# Altium schematic sheet Sheet1 (1).SchDoc
size 594 x 420 mm; Organization: ФЕЛ, ДК-81; DocumentNumber: 1; SheetNumber: 1; SheetTotal: 1
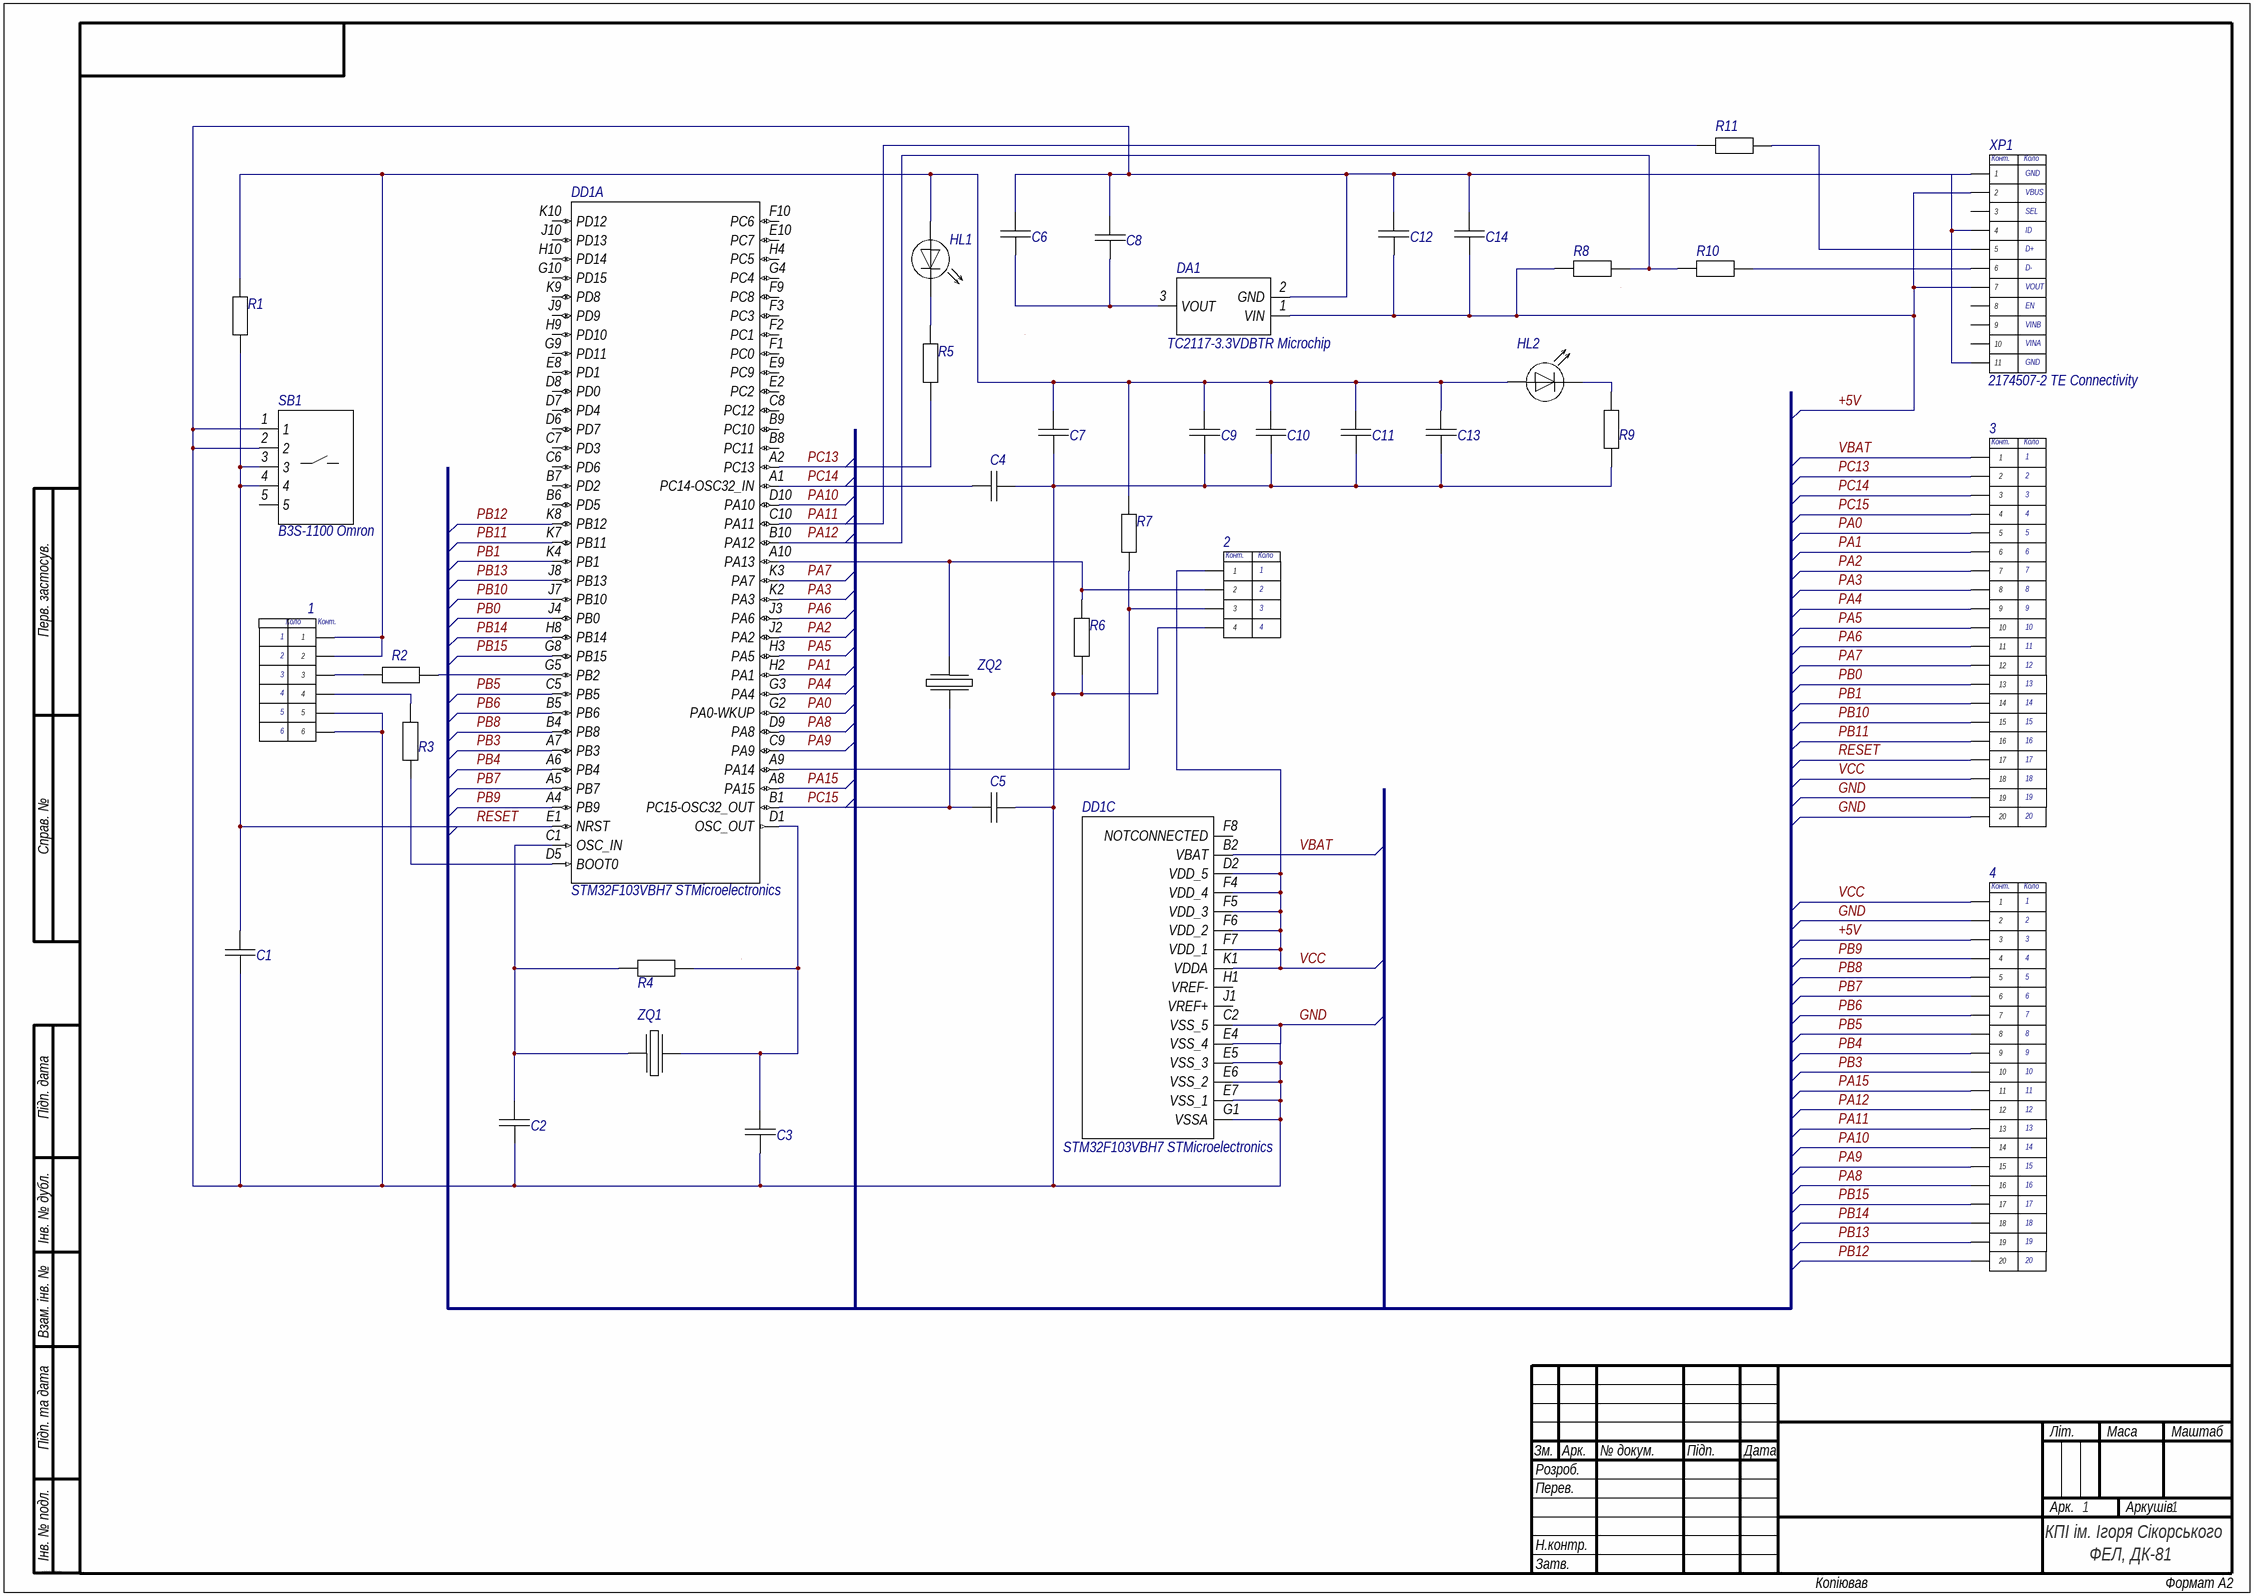
[diagram p0: Sheet1 (1).SchDoc]

## Parts
1  pin_boot  [PIN_BOOT]  (value not drawn)
2  pins_jtag  [PIN_JTAG]  (value not drawn)
3  pin_left  [pin_left]  (value not drawn)
4  pin_right  [pin_right]  (value not drawn)
C1  0603 63 В 1 мкФ 10% *  [C_0603]  (value not drawn)
C2  0603 63 В 20 пФ 10% *  [C_0603]  (value not drawn)
C3  0603 63 В 20 пФ 10% *  [C_0603]  (value not drawn)
C4  0603 63 В 20 пФ 10% *  [C_0603]  (value not drawn)
C5  0603 63 В 20 пФ 10% *  [C_0603]  (value not drawn)
C6  0603 63 В 100 нФ 10% *  [C_0603]  (value not drawn)
C7  0603 63 В 100 нФ 10% *  [C_0603]  (value not drawn)
C8  CASE-C_6032 63 В 330 мкФ 10% *  [CAPMP6.3X3.2_2.8N_KEM]  (value not drawn)
C9  0603 63 В 100 нФ 10% *  [C_0603]  (value not drawn)
C10  0603 63 В 100 нФ 10% *  [C_0603]  (value not drawn)
C11  0603 63 В 100 нФ 10% *  [C_0603]  (value not drawn)
C12  CASE-C_6032 63 В 100 мкФ 10% *  [CAPMP6.3X3.2_2.8N_KEM]  (value not drawn)
C13  0603 63 В 100 нФ 10% *  [C_0603]  (value not drawn)
C14  CASE-C_6032 63 В 100 мкФ 10% *  [CAPMP6.3X3.2_2.8N_KEM]  (value not drawn)
DA1  TC2117-3.3VDBTR Microchip  [TC2117]
DD1  STM32F103VBH7 STMicroelectronics  [LFBGA100]  (parts A,C of 3)
HL1  XL-0603QYGC KENTO  [LED_DIALIGHT_598_DIA-M]  (value not drawn)
HL2  XL-0603QYGC KENTO  [LED_DIALIGHT_598_DIA-M]  (value not drawn)
R1  R-0603 0.1 Вт 10 кОм 10% Yageo  [R_0603]  (value not drawn)
R2  R-0603 0.1 Вт 100 кОм 10% Yageo  [R_0603]  (value not drawn)
R3  R-0603 0.1 Вт 100 кОм 10% Yageo  [R_0603]  (value not drawn)
R4  R-0603 0.1 Вт 1 МОм 10% Yageo  [R_0603]  (value not drawn)
R5  R-0603 0.1 Вт 510 Ом 10% Yageo  [R_0603]  (value not drawn)
R6  R-0603 0.1 Вт 10 кОм 10% Yageo  [R_0603]  (value not drawn)
R7  R-0603 0.1 Вт 10 кОм 10% Yageo  [R_0603]  (value not drawn)
R8  R-0603 0.1 Вт 1.5 кОм 10% Yageo  [R_0603]  (value not drawn)
R9  R-0603 0.1 Вт 510 Ом 10% Yageo  [R_0603]  (value not drawn)
R10  R-0603 0.1 Вт 20 Ом 10% Yageo  [R_0603]  (value not drawn)
R11  R-0603 0.1 Вт 20 Ом 10% Yageo  [R_0603]  (value not drawn)
SB1  B3S-1100 Omron  [SW_B3S-1100_OMR]
XP1  2174507-2 TE Connectivity  [CONN5_2013499-1_TEC - duplicate]
ZQ1  OSC_8M LCSC  [HC-49S]  (value not drawn)
ZQ2  OSC_32.7K LCSC  [SOJ_MC-306_EPS]  (value not drawn)

## Nets
+5V: 4.3 C12.1 C14.1 DA1.1(VIN) R8.1 XP1.2 XP1.7
GND: 1.5 1.6 2.4 3.19 3.20 4.2 C1.1 C2.1 C3.1 C4.2 C5.2 C6.2 C7.1 C8.2 C9.1 C10.1 C11.1 C12.2 C13.1 C14.2 DA1.2(GND) DD1.C2(VSS_5) DD1.E4(VSS_4) DD1.E5(VSS_3) DD1.E6(VSS_2) DD1.E7(VSS_1) DD1.G1(VSSA) R6.1 R9.1 SB1.1 SB1.2 XP1.1 XP1.4 XP1.11
PA0: 3.5 DD1.G2(PA0-WKUP)
PA1: 3.6 DD1.H2(PA1)
PA2: 3.7 DD1.J2(PA2)
PA3: 3.8 DD1.K2(PA3)
PA4: 3.9 DD1.G3(PA4)
PA5: 3.10 DD1.H3(PA5)
PA6: 3.11 DD1.J3(PA6)
PA7: 3.12 DD1.K3(PA7)
PA8: 4.16 DD1.D9(PA8)
PA9: 4.15 DD1.C9(PA9)
PA10: 4.14 DD1.D10(PA10)
PA11: 4.13 DD1.C10(PA11) R11.1
PA12: 4.12 DD1.B10(PA12) R8.2 R10.1
PA15: 4.11 DD1.A8(PA15)
PB0: 3.13 DD1.J4(PB0)
PB1: 3.14 DD1.K4(PB1)
PB3: 4.10 DD1.A7(PB3)
PB4: 4.9 DD1.A6(PB4)
PB5: 4.8 DD1.C5(PB5)
PB6: 4.7 DD1.B5(PB6)
PB7: 4.6 DD1.A5(PB7)
PB8: 4.5 DD1.B4(PB8)
PB9: 4.4 DD1.A4(PB9)
PB10: 3.15 DD1.J7(PB10)
PB11: 3.16 DD1.K7(PB11)
PB12: 4.20 DD1.K8(PB12)
PB13: 4.19 DD1.J8(PB13)
PB14: 4.18 DD1.H8(PB14)
PB15: 4.17 DD1.G8(PB15)
PC13: 3.2 DD1.A2(PC13) R5.1
PC14: 3.3 C4.1 DD1.A1(PC14-OSC32_IN)
PC15: 3.4 C5.1 DD1.B1(PC15-OSC32_OUT) ZQ2.2
RESET: 3.17 C1.2 DD1.E1(NRST) R1.1 SB1.3 SB1.4
VBAT: 3.1 DD1.B2(VBAT)
VCC: 2.1 3.18 4.1 DD1.D2(VDD_5) DD1.F4(VDD_4) DD1.F5(VDD_3) DD1.F6(VDD_2) DD1.F7(VDD_1) DD1.K1(VDDA)
Net1_1: 1.1 1.2 C7.2 C9.2 C10.2 C11.2 C13.2 HL1.1 HL2.1 R1.2 R7.2
Net1_3: 1.3 R2.1
Net1_4: 1.4 R3.2
Net2_2: 2.2 DD1.A10(PA13) R6.2 ZQ2.1
Net2_3: 2.3 DD1.A9(PA14) R7.1
NetC2_2: C2.2 DD1.C1(OSC_IN) R4.2 ZQ1.1
NetC3_2: C3.2 DD1.D1(OSC_OUT) R4.1 ZQ1.2
NetC6_1: C6.1 C8.1 DA1.3(VOUT)
NetDD1_D5: DD1.D5(BOOT0) R3.1
NetDD1_G5: DD1.G5(PB2) R2.2
NetHL1_2: HL1.2 R5.2
NetHL2_2: HL2.2 R9.2
NetR10_2: R10.2 XP1.6
NetR11_2: R11.2 XP1.5

Not connected (* = marked no-connect by the designer): DD1 B6(PD5) B7(PD2) B8(PC11) B9(PC10) C6(PD6) C7(PD3) C8(PC12) D6(PD7) D7(PD4) D8(PD0) E2(PC2) E8(PD1) E9(PC9) E10(PC7) F1(PC0) F2(PC1) F3(PC3) F8(NOTCONNECTED) F9(PC8) F10(PC6) G4(PC4) G9(PD11) G10(PD15) H1(VREF-) H4(PC5) H9(PD10) H10(PD14) J1(VREF+) J9(PD9) J10(PD13) K9(PD8) K10(PD12); SB1 5; XP1 3 8 9 10

## Notes on the sheet
- Перв. застосув.
- Справ. №
- Підп. дата
- Інв. № дубл.
- Взам. інв. №
- Підп. та дата
- Зм.
- Розроб.
- Арк.
- № докум.
- Підп.
- Дата
- Літ.
- Маса
- Маштаб
- Перев.
- Аркушів
- Інв. № подл.
- Н.контр.
- Затв.
- КПІ ім. Ігоря Сікорського
- ALTIUM GOSTBOM2.0 KEV
- Копіював
- Формат А2
- (in symbol 2174507-2) Конт.; Коло; GND; VBUS; SEL; ID; D+; D-; VOUT; EN; VINB; VINA
- (in symbol pin_boot) Коло; Конт.
- (in symbol pin_left) Конт.; Коло
- (in symbol pin_right) Конт.; Коло
- (in symbol pins_jtag) Конт.; Коло

## Library data of the parts
1 = pin_boot: pads
2 = pins_jtag: pads
3 = pin_left: pads
4 = pin_right: pads
C1 = C 1 мкФ: Voltage: 63 В; Value: 1 мкФ; Package: 0603; Tolerance: 10%; Temp_Coef: *; Manufacturer: *
C2-C5 = C 20 пФ: Voltage: 63 В; Value: 20 пФ; Package: 0603; Tolerance: 10%; Temp_Coef: *; Manufacturer: *
C6 C7 C9-C11 C13 = C 100 нФ: Voltage: 63 В; Value: 100 нФ; Package: 0603; Tolerance: 10%; Temp_Coef: *; Manufacturer: *
C8 = C 330 мкФ: Voltage: 63 В; Value: 330 мкФ; Package: CASE-C_6032; Tolerance: 10%; Temp_Coef: *; Manufacturer: *
C12 C14 = C 100 мкФ: Voltage: 63 В; Value: 100 мкФ; Package: CASE-C_6032; Tolerance: 10%; Temp_Coef: *; Manufacturer: *
DA1 = TC2117-3.3VDBTR: Manufacturer: Microchip; Name: TC2117-3.3VDBTR
DD1 = STM32F103VBH7: Manufacturer: STMicroelectronics; Name: STM32F103VBH7
HL1 HL2 = LED-0603: Name: XL-0603QYGC; Manufacturer: KENTO
R1 R6 R7 = R 10 кОм: Power: 0.1 Вт; Value: 10 кОм; Package: R-0603; Tolerance: 10%; Manufacturer: Yageo
R2 R3 = R 100 кОм: Power: 0.1 Вт; Value: 100 кОм; Package: R-0603; Tolerance: 10%; Manufacturer: Yageo
R4 = R 1 МОм: Power: 0.1 Вт; Value: 1 МОм; Package: R-0603; Tolerance: 10%; Manufacturer: Yageo
R5 R9 = R 510 Ом: Power: 0.1 Вт; Value: 510 Ом; Package: R-0603; Tolerance: 10%; Manufacturer: Yageo
R8 = R 1.5 кОм: Power: 0.1 Вт; Value: 1.5 кОм; Package: R-0603; Tolerance: 10%; Manufacturer: Yageo
R10 R11 = R 20 Ом: Power: 0.1 Вт; Value: 20 Ом; Package: R-0603; Tolerance: 10%; Manufacturer: Yageo
SB1 = B3S-1100: Manufacturer: Omron; Name: B3S-1100
XP1 = 2174507-2: usb; Manufacturer: TE Connectivity; Name: 2174507-2
ZQ1 = OSC_8M: Name: OSC_8M; Manufacturer: LCSC
ZQ2 = OSC_32.7K: Name: OSC_32.7K; Manufacturer: LCSC